# EAGLE design YOTSUBA_MC_ver.2.2.1 (EAGLE 9.6.2)
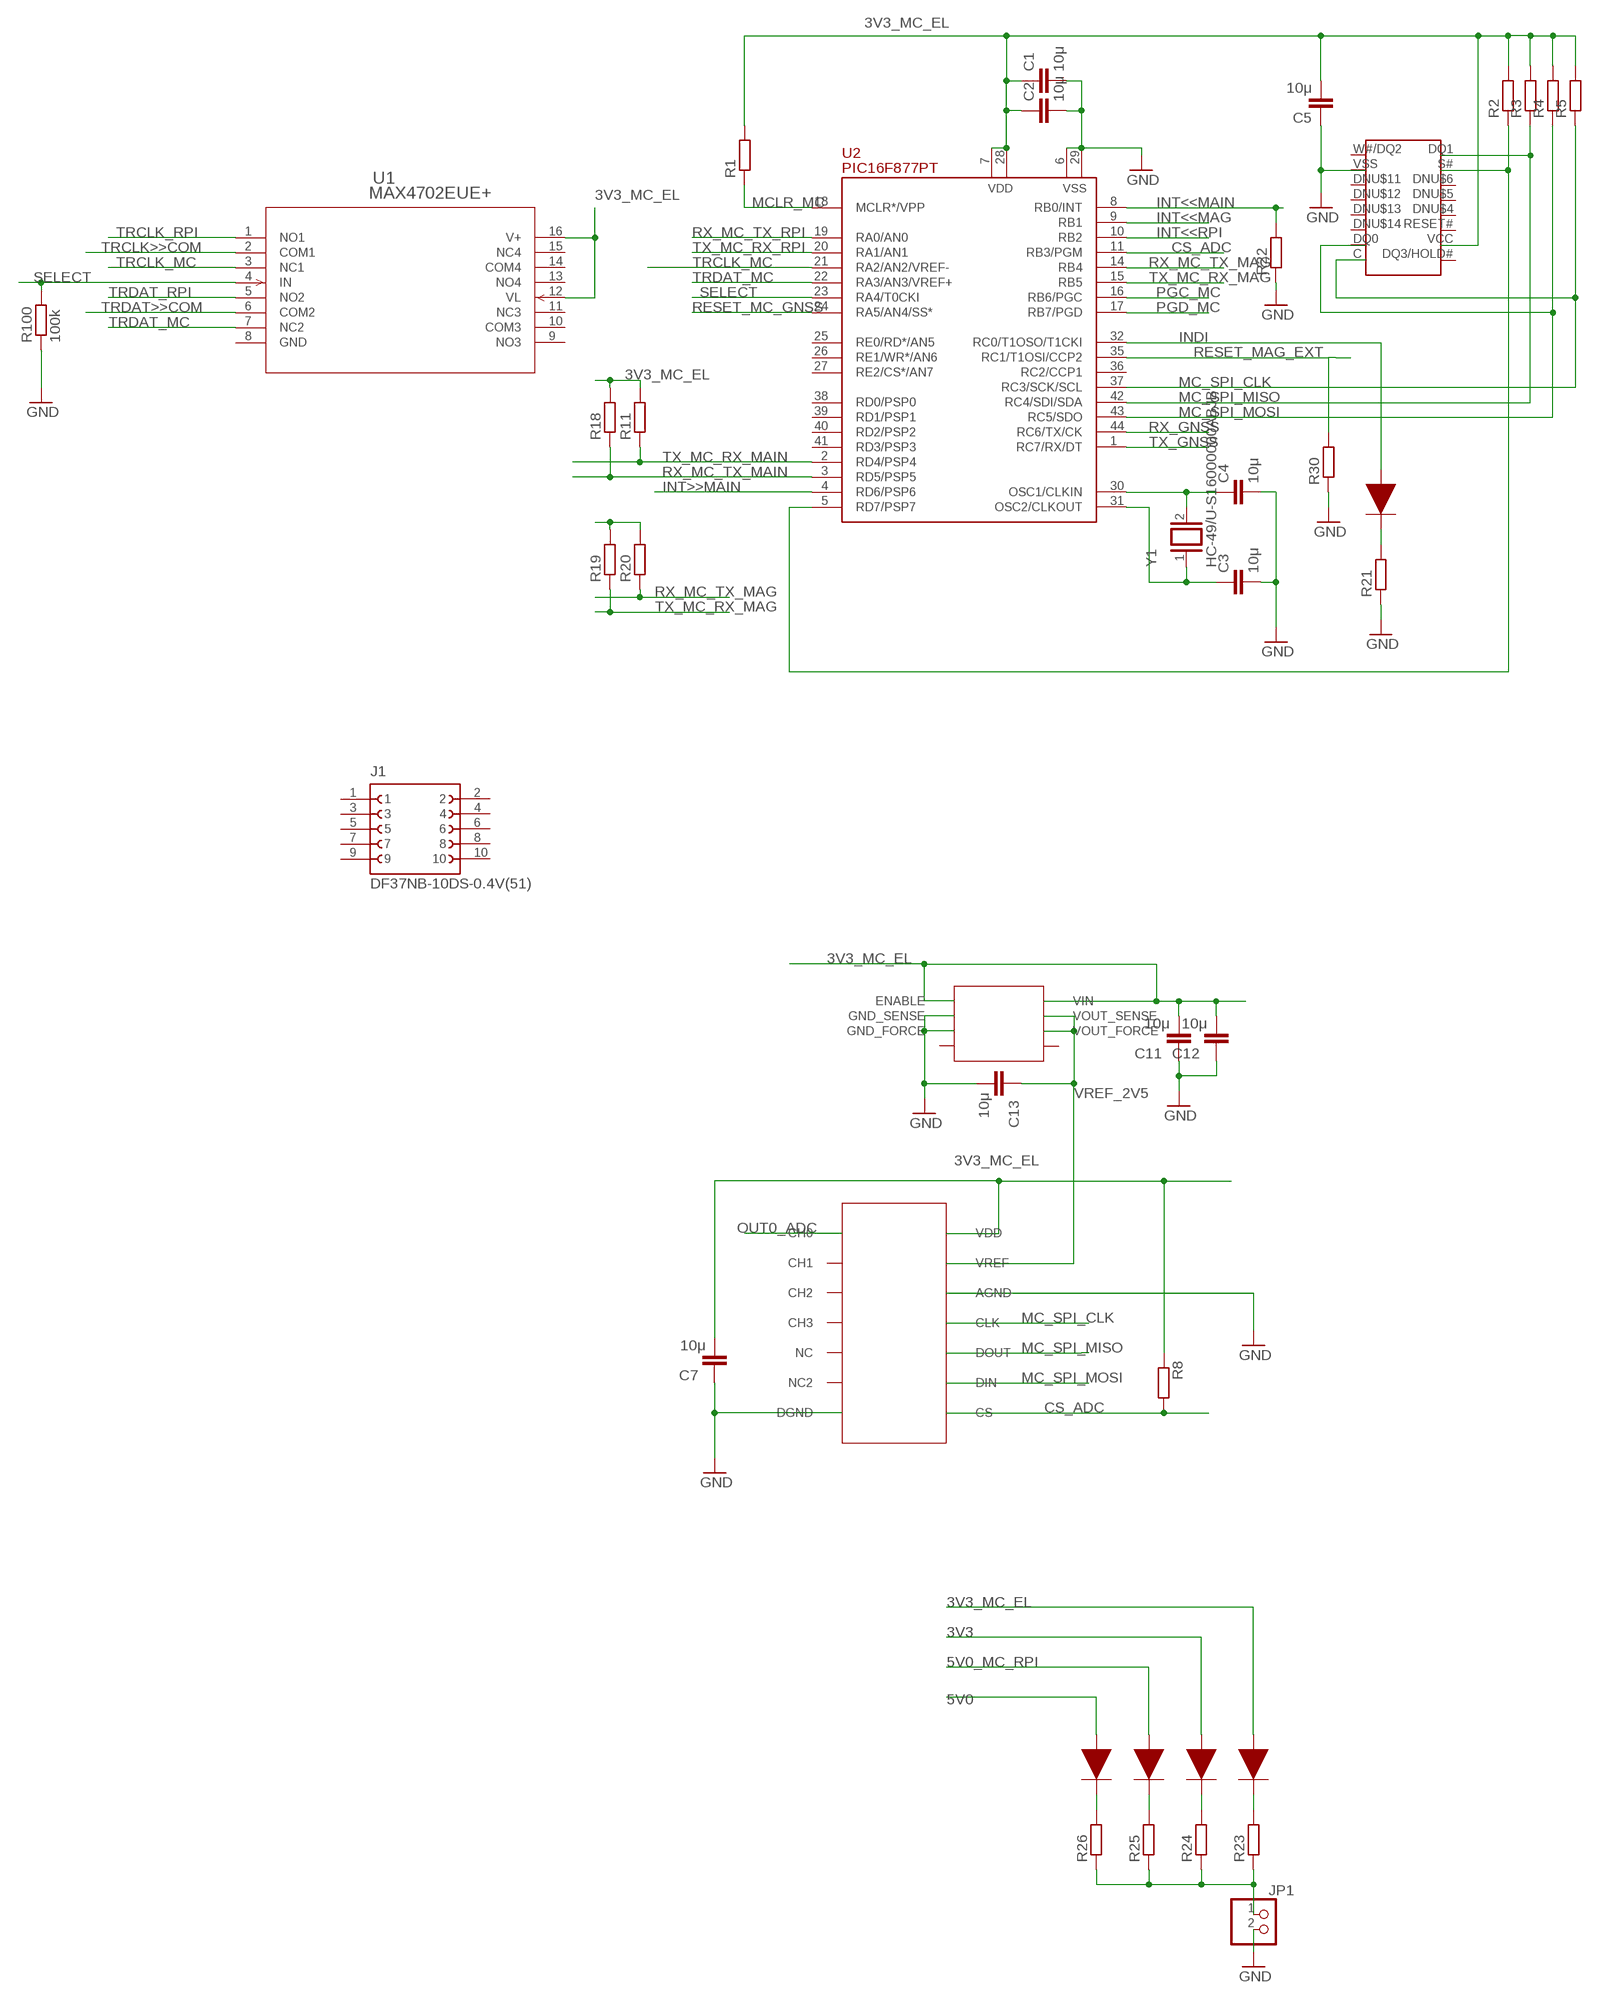
[diagram p0: schematic, sheet 1, part 1 of 2]
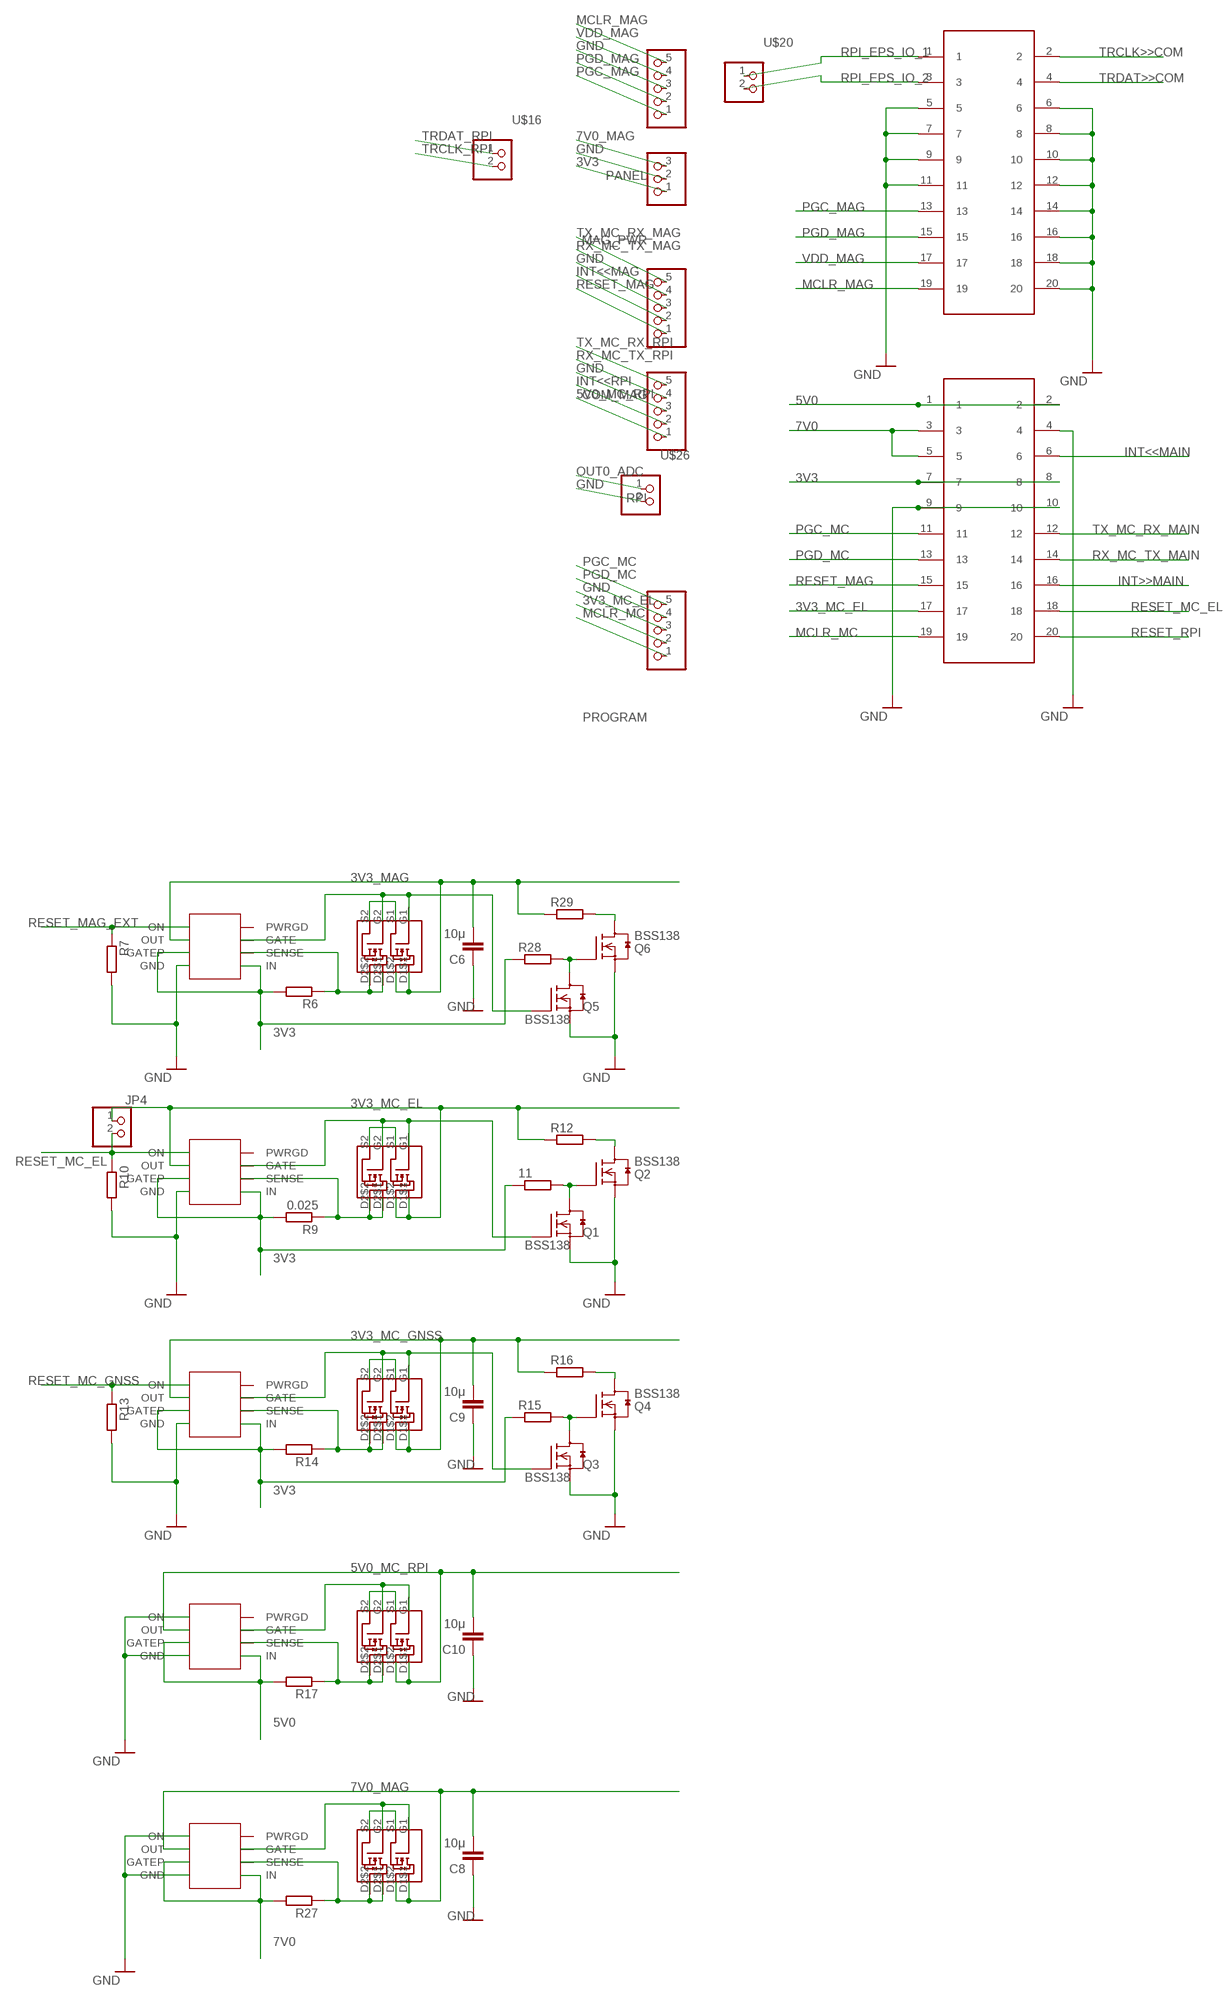
[diagram p1: schematic, sheet 1, part 2 of 2]

## Parts
11  R-EU_M2012  [M2012]
C1  10μ  C-EUC2012  [C2012]
C2  10μ  C-EUC2012  [C2012]
C3  10μ  C-EUC2012  [C2012]
C4  10μ  C-EUC2012  [C2012]
C5  10μ  C-EUC2012  [C2012]
C6  10μ  C-EUC2012  [C2012]
C7  10μ  C-EUC2012  [C2012]
C8  10μ  C-EUC2012  [C2012]
C9  10μ  C-EUC2012  [C2012]
C10  10μ  C-EUC2012  [C2012]
C11  10μ  C-EUC2012  [C2012]
C12  10μ  C-EUC2012  [C2012]
C13  10μ  C-EUC2012  [C2012]
COM_MAG  PINHD-1X5  [1X05]
J1  DF37NB-10DS-0.4V(51)  [HRS_DF37NB-10DS-0.4V(51)]
JP1  PINHD-1X2  [1X02]
JP4  PINHD-1X2  [1X02]
MAG_PWR  PINHD-1X3  [1X03]
PANEL  PINHD-1X5  [1X05]
PROGRAM  PINHD-1X5  [1X05]
Q1  BSS138  [SOT23]
Q2  BSS138  [SOT23]
Q3  BSS138  [SOT23]
Q4  BSS138  [SOT23]
Q5  BSS138  [SOT23]
Q6  BSS138  [SOT23]
R1  R-EU_M2012  [M2012]
R2  R-EU_M2012  [M2012]
R3  R-EU_M2012  [M2012]
R4  R-EU_M2012  [M2012]
R5  R-EU_M2012  [M2012]
R6  R-EU_M2012  [M2012]
R7  R-EU_M2012  [M2012]
R8  R-EU_M2012  [M2012]
R9  0.025  R-EU_M2012  [M2012]
R10  R-EU_M2012  [M2012]
R11  R-EU_M2012  [M2012]
R12  R-EU_M2012  [M2012]
R13  R-EU_M2012  [M2012]
R14  R-EU_M2012  [M2012]
R15  R-EU_M2012  [M2012]
R16  R-EU_M2012  [M2012]
R17  R-EU_M2012  [M2012]
R18  R-EU_M2012  [M2012]
R19  R-EU_M2012  [M2012]
R20  R-EU_M2012  [M2012]
R21  R-EU_M2012  [M2012]
R22  R-EU_M2012  [M2012]
R23  R-EU_M2012  [M2012]
R24  R-EU_M2012  [M2012]
R25  R-EU_M2012  [M2012]
R26  R-EU_M2012  [M2012]
R27  R-EU_M2012  [M2012]
R28  R-EU_M2012  [M2012]
R29  R-EU_M2012  [M2012]
R30  R-EU_M2012  [M2012]
R100  100k  R-EU_M2012  [M2012]
RPI  PINHD-1X5  [1X05]
U1  MAX4702EUE+  [21-0066J_16]
U2  PIC16F877PT  [TQFP44]
U$1  MT25QL512_16SOP2  [SOIC127P1032X265-16N]
U$2  DMG6898LSD  [SOIC127P600X150-8N]
U$3  LTC4361  [SOP65P280X100-8N]
U$6  MCP3204_S  [MCP3204_S]
U$7  DMG6898LSD  [SOIC127P600X150-8N]
U$8  LTC4361  [SOP65P280X100-8N]
U$9  DMG6898LSD  [SOIC127P600X150-8N]
U$10  DMG6898LSD  [SOIC127P600X150-8N]
U$11  LTC4361  [SOP65P280X100-8N]
U$12  LTC4361  [SOP65P280X100-8N]
U$13  DMG6898LSD  [SOIC127P600X150-8N]
U$14  LTC4361  [SOP65P280X100-8N]
U$16  PINHD-1X2  [1X02]
U$17  M50-3001045  [M50-3001045]
U$18  LED_1608  [LED_1608]
U$19  ADR35XX  [SOP65P490X110-8N]
U$20  PINHD-1X2  [1X02]
U$21  LED_1608  [LED_1608]
U$22  M50-3001045  [M50-3001045]
U$23  LED_1608  [LED_1608]
U$24  LED_1608  [LED_1608]
U$25  LED_1608  [LED_1608]
U$26  PINHD-1X2  [1X02]
Y1  HC-49/U-S16000000ABJB  [XTAL_HC49P488W43L1150T466H350]

## Nets
3V3 [POWER]: 11.1 MAG_PWR.1 R6.2 R9.2 R14.2 R15.1 R28.1 U$3.GATEP U$3.IN U$8.GATEP U$8.IN U$11.GATEP U$11.IN U$17.7 U$17.8 U$23.A
3V3_MAG [POWER]: C6.2 R29.1 U$2.D1$1 U$2.D1$2 U$3.OUT
3V3_MC_EL [POWER]: C1.1 C2.1 C5.2 C7.2 C11.2 C12.2 JP4.1 PROGRAM.2 R1.2 R2.2 R3.2 R4.2 R5.2 R8.1 R11.2 R12.1 R18.2 U1.12(VL) U1.16(V+) U2.7(VDD) U2.28(VDD) U$1.VCC U$6.VDD U$7.D1$1 U$7.D1$2 U$8.OUT U$17.17 U$19.ENABLE U$19.VIN U$21.A
3V3_MC_GNSS [POWER]: C9.2 R16.1 U$10.D1$1 U$10.D1$2 U$11.OUT
5V0 [POWER]: R17.2 U$14.GATEP U$14.IN U$17.1 U$17.2 U$25.A
5V0_MC_RPI [POWER]: C10.2 RPI.1 U$13.D1$1 U$13.D1$2 U$14.OUT U$24.A
7V0 [POWER]: R27.2 U$12.GATEP U$12.IN U$17.3 U$17.5
7V0_MAG [POWER]: C8.2 MAG_PWR.3 U$9.D1$1 U$9.D1$2 U$12.OUT
CS_ADC: R8.2 U2.11(RB3/PGM) U$6.CS
GND [gnd]: C1.2 C2.2 C3.2 C4.2 C5.1 C6.1 C7.1 C8.1 C9.1 C10.1 C11.1 C12.1 C13.2 COM_MAG.3 JP1.2 MAG_PWR.2 PANEL.3 PROGRAM.3 Q1.2(S) Q2.2(S) Q3.2(S) Q4.2(S) Q5.2(S) Q6.2(S) R7.2 R10.2 R13.2 R21.1 R22.1 R30.1 R100.1 RPI.3 U2.6(VSS) U2.29(VSS) U$1.VSS U$3.GND U$6.AGND U$6.DGND U$8.GND U$11.GND U$12.GND U$12.ON U$14.GND U$14.ON U$17.4 U$17.9 U$17.10 U$19.GND_FORCE U$19.GND_SENSE U$22.5 U$22.6 U$22.7 U$22.8 U$22.9 U$22.10 U$22.11 U$22.12 U$22.14 U$22.16 U$22.18 U$22.20 U$26.2
INDI: U2.32(RC0/T1OSO/T1CKI) U$18.A
INT<<MAG: COM_MAG.2 U2.9(RB1)
INT<<MAIN: R22.2 U2.8(RB0/INT) U$17.6
INT<<RPI: RPI.2 U2.10(RB2)
INT>>MAIN: U2.4(RD6/PSP6) U$17.16
MC_SPI_CLK: R5.1 U2.37(RC3/SCK/SCL) U$1.C U$6.CLK
MC_SPI_MISO: R3.1 U2.42(RC4/SDI/SDA) U$1.DQ1 U$6.DOUT
MC_SPI_MOSI: R4.1 U2.43(RC5/SDO) U$1.DQ0 U$6.DIN
MCLR_MAG: PANEL.5 U$22.19
MCLR_MC: PROGRAM.1 R1.1 U2.18(MCLR*/VPP) U$17.19
N$1: R19.2 R20.2
N$2: R23.2 U$21.C
N$3: C3.1 U2.31(OSC2/CLKOUT) Y1.1
N$4: R24.2 U$23.C
N$5: C4.1 U2.30(OSC1/CLKIN) Y1.2
N$6: R25.2 U$24.C
N$7: R26.2 U$25.C
N$8: R2.1 U2.5(RD7/PSP7) U$1.S#
N$9: JP1.1 R23.1 R24.1 R25.1 R26.1
N$10: U$2.S1 U$2.S2
N$11: R6.1 U$2.D2$1 U$2.D2$2 U$3.SENSE
N$12: Q5.1(G) U$2.G1 U$2.G2 U$3.GATE
N$13: Q5.3(D) Q6.1(G) R28.2
N$14: U$9.S1 U$9.S2
N$15: R21.2 U$18.C
N$16: R27.1 U$9.D2$1 U$9.D2$2 U$12.SENSE
N$17: U$9.G1 U$9.G2 U$12.GATE
N$18: Q6.3(D) R29.2
N$19: U$7.S1 U$7.S2
N$20: R9.1 U$7.D2$1 U$7.D2$2 U$8.SENSE
N$22: Q1.1(G) U$7.G1 U$7.G2 U$8.GATE
N$24: 11.2 Q1.3(D) Q2.1(G)
N$26: Q2.3(D) R12.2
N$28: U$10.S1 U$10.S2
N$29: R14.1 U$10.D2$1 U$10.D2$2 U$11.SENSE
N$30: Q3.1(G) U$10.G1 U$10.G2 U$11.GATE
N$33: Q3.3(D) Q4.1(G) R15.2
N$34: Q4.3(D) R16.2
N$36: U$13.S1 U$13.S2
N$37: R17.1 U$13.D2$1 U$13.D2$2 U$14.SENSE
N$38: U$13.G1 U$13.G2 U$14.GATE
OUT0_ADC: U$6.CH0 U$26.1
PGC_MAG: PANEL.1 U$22.13
PGC_MC: PROGRAM.5 U2.16(RB6/PGC) U$17.11
PGD_MAG: PANEL.2 U$22.15
PGD_MC: PROGRAM.4 U2.17(RB7/PGD) U$17.13
RESET_MAG: COM_MAG.1 U$17.15
RESET_MAG_EXT: R7.1 R30.2 U2.35(RC1/T1OSI/CCP2) U$3.ON
RESET_MC_EL: JP4.2 R10.1 U$8.ON U$17.18
RESET_MC_GNSS: R13.1 U2.24(RA5/AN4/SS*) U$11.ON
RESET_RPI: U$17.20
RPI_EPS_IO_1: U$20.1 U$22.1
RPI_EPS_IO_2: U$20.2 U$22.3
RX_GNSS: U2.44(RC6/TX/CK)
RX_MC_TX_MAG: COM_MAG.4 R20.1 U2.14(RB4)
RX_MC_TX_MAIN: R18.1 U2.3(RD5/PSP5) U$17.14
RX_MC_TX_RPI: RPI.4 U2.19(RA0/AN0)
SELECT: R100.2 U1.4(IN) U2.23(RA4/T0CKI)
TRCLK>>COM: U1.2(COM1) U$22.2
TRCLK_MC: U1.3(NC1) U2.21(RA2/AN2/VREF-)
TRCLK_RPI: U1.1(NO1) U$16.1
TRDAT>>COM: U1.6(COM2) U$22.4
TRDAT_MC: U1.7(NC2) U2.22(RA3/AN3/VREF+)
TRDAT_RPI: U1.5(NO2) U$16.2
TX_GNSS: U2.1(RC7/RX/DT)
TX_MC_RX_MAG: COM_MAG.5 R19.1 U2.15(RB5)
TX_MC_RX_MAIN: R11.1 U2.2(RD4/PSP4) U$17.12
TX_MC_RX_RPI: RPI.5 U2.20(RA1/AN1)
VDD_MAG: PANEL.4 U$22.17
VREF_2V5: C13.1 U$6.VREF U$19.VOUT_FORCE U$19.VOUT_SENSE
Unconnected: J1.1 J1.2 J1.3 J1.4 J1.5 J1.6 J1.7 J1.8 J1.9 J1.10 U1.9(NO3) U1.10(COM3) U1.11(NC3) U1.13(NO4) U1.14(COM4) U1.15(NC4) U2.25(RE0/RD*/AN5) U2.26(RE1/WR*/AN6) U2.27(RE2/CS*/AN7) U2.36(RC2/CCP1) U2.38(RD0/PSP0) U2.39(RD1/PSP1) U2.40(RD2/PSP2) U2.41(RD3/PSP3) U$1.DNU$4 U$1.DNU$5 U$1.DNU$6 U$1.DNU$11 U$1.DNU$12 U$1.DNU$13 U$1.DNU$14 U$1.DQ3/HOLD# U$1.RESET# U$1.W#/DQ2 U$3.PWRGD U$6.CH1 U$6.CH2 U$6.CH3 U$6.NC1(NC) U$6.NC2 U$8.PWRGD U$11.PWRGD U$12.PWRGD U$14.PWRGD U$19.NIC@1(NIC) U$19.NIC@2(NIC)

## Power pins joined to a net without a drawn wire
GND: U1.8(GND)

## Library data of the parts
11 R1-R30 R100 = rcl:R-EU_: RESISTOR, European symbol; SPICEPREFIX: R
C1-C13 = rcl:C-EU: CAPACITOR, European symbol; SPICEPREFIX: C
COM_MAG PANEL PROGRAM RPI = pinhead:PINHD-1X5: PIN HEADER
J1 = DF37NB-10DS-0.4V_51_:DF37NB-10DS-0.4V(51): Check availability <https://pricing.snapeda.com/parts/DF37NB-10DS-0.4V%2851%29/Hirose/view-part?ref=eda>; AVAILABILITY: In Stock; DESCRIPTION: 10 Position Connector Receptacle, Center Strip Contacts Surface Mount Gold; MF: Hirose; MP: DF37NB-10DS-0.4V(51); PACKAGE: None; PRICE: None; PURCHASE-URL: https://pricing.snapeda.com/search?q=DF37NB-10DS-0.4V(51)&ref=eda
JP1 JP4 U$16 U$20 U$26 = pinhead:PINHD-1X2: PIN HEADER
MAG_PWR = pinhead:PINHD-1X3: PIN HEADER
Q1-Q6 = m-pad-2.1:BSS138: Fairchild Semiconductors BSS138 N-Channel Logic Level Enhancement Mode Field Effect Transistor General Description: These N-Channel enhancement mode field effect transistors are produced using Fairchild's proprietary, high cell density, DMOS technology. These products have been designed to minimize on-state resistance while provide rugged, reliable, and fast switching performance.These products are particularly suited for low voltage, low current applications such as small servo motor control, power MOSFET gate drivers, and other switching applications. Features: 0.22 A, 50 V. RDS(ON) = 3.5Ohm @ VGS = 10 V RDS(ON) = 6.0Ohm @ VGS = 4.5 V High density cell design for extremely low RDS(ON) Rugged and Reliable Compact industry standard SOT-23 surface mount package Please send any comments to: messi@users.sourceforge.net
U1 = MAX4702:MAX4702EUE+; COPYRIGHT: Copyright (C) 2022 Ultra Librarian. All rights reserved.; MANUFACTURER_PART_NUMBER: MAX4702EUE+; MFR_NAME: Analog Devices Inc
U2 = aoba01:PIC16F877: FLASH MICROCONTROLLER
U$1 = MT25QL512_8:MT25QL512_16SOP2
U$2 U$7 U$9 U$10 U$13 = DMG6898LSD:DMG6898LSD
U$3 U$8 U$11 U$12 U$14 = ltc4361:LTC4361
U$6 = mcp3204_S:MCP3204_S
U$17 U$22 = MITSUBA_Connectors-v4.0:M50-3001045: 20pins 1.27mm pitch 2line pinsocket
U$18 U$21 U$23-U$25 = LED_1608:LED_1608
U$19 = adr35xx:ADR35XX
Y1 = HC-49_U-S16000000ABJB:HC-49/U-S16000000ABJB: HC49US Series 16 MHz ±30 ppm 18 pF -20 to +70 °C Through Hole AT-CUT Crystal; DESCRIPTION: 16 MHz ±30ppm Crystal 18pF 50 Ohms HC-49/US; DIGI-KEY_PART_NUMBER: 300-6034-ND; MF: Citizen Finedevice Co Ltd; MP: HC-49/U-S16000000ABJB; PACKAGE: HC-49/US Citizen Finetech Miyota; PURCHASE-URL: https://pricing.snapeda.com/search?q=HC-49/U-S16000000ABJB&ref=eda

## Net classes
0 default: clearance 0.178 mm
1 ant: clearance 0.559 mm
2 gnd: clearance 0.508 mm
3 POWER: width 0.305 mm, clearance 0.254 mm

## Board
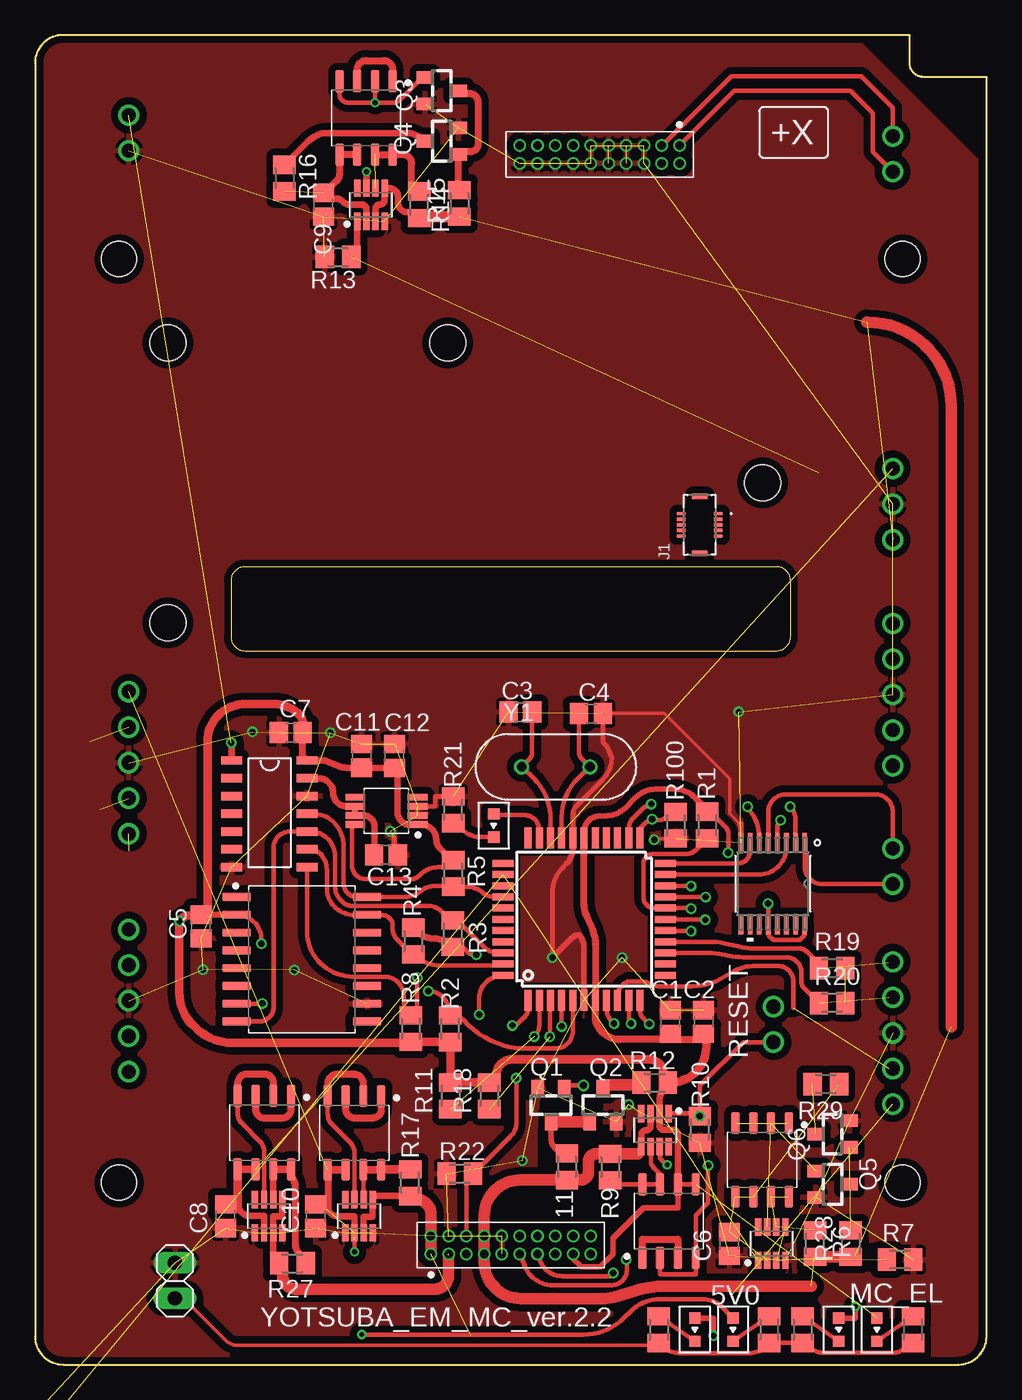
[diagram p2: board, top side]
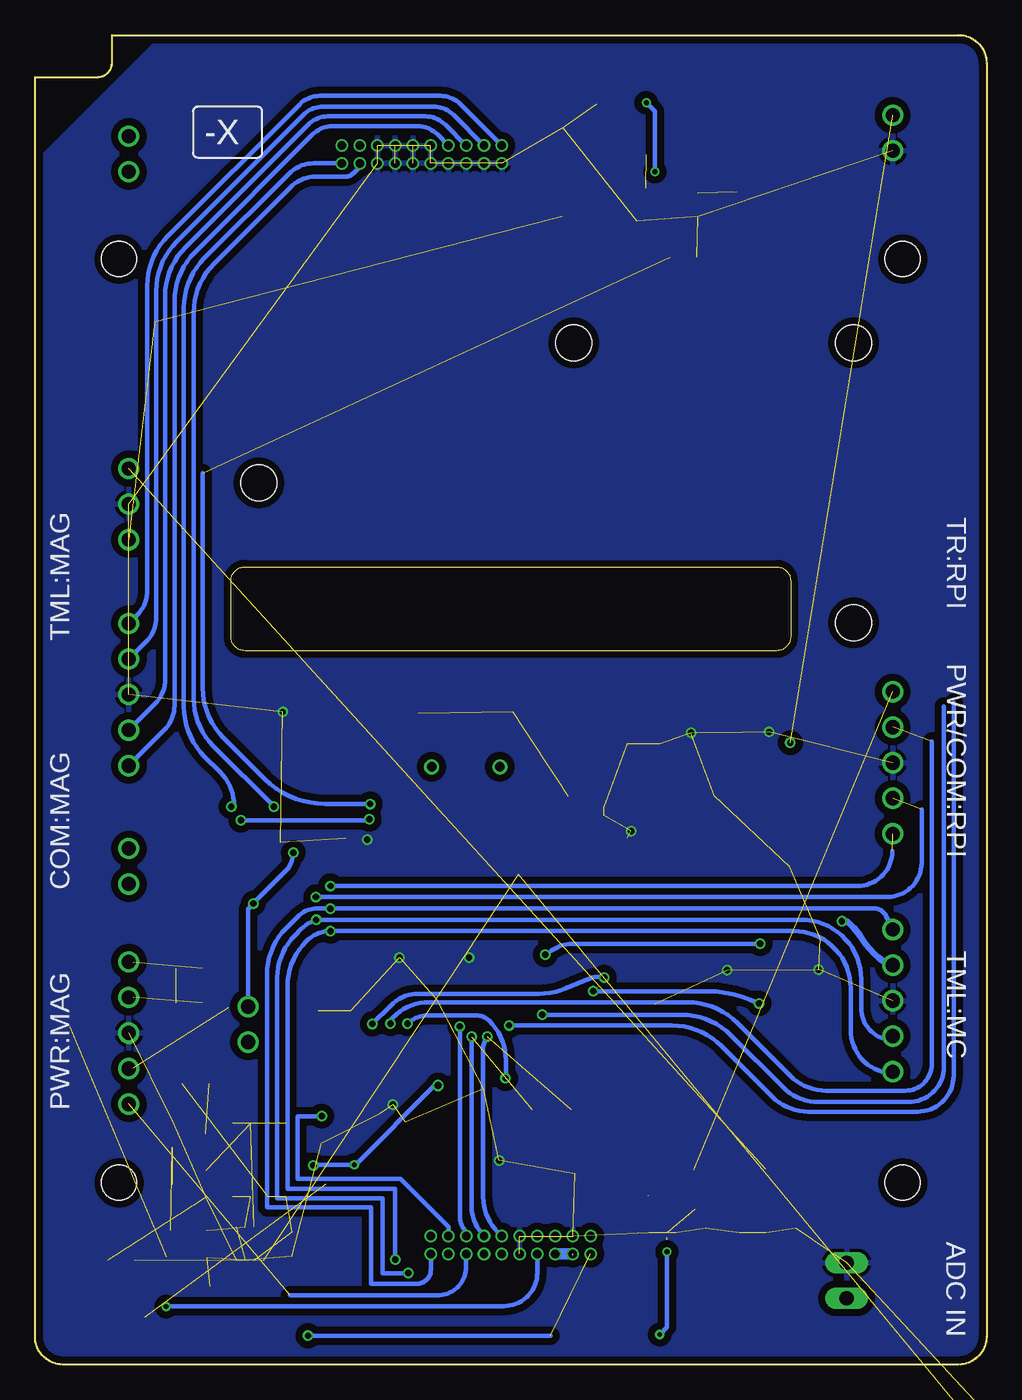
[diagram p3: board, bottom side, seen from below]

Size 68 x 95 mm. Coordinates in mm from the lower left corner, seen from the top.
Outline: 0,93 0,2 arc90 2,0 66,0 arc90 68,2 68,92 63.5,92 arc-90 62.5,93 62.5,95 2,95 arc90 0,93
Outline: 14,56 14,52 arc90 15,51 53,51 arc90 54,52 54,56 arc90 53,57 15,57 arc90 14,56
Copper layers (1*16): Top 0.035mm / dielectric 1.53mm / Bottom 0.035mm
Design rules "pban_5mil-l2": minimum track width 5mil, minimum drill 0.3mm, track to track 5mil, track to pad 0.229mm, pad to pad 5mil, via to via 5mil, smd to smd 5mil, copper to edge 0.5mm, drill to drill 0.5mm, minimum pad ring 0.15mm, minimum via ring 0.15mm, stop-mask expansion 4mil, vias tented up to drill 0.35mm, thermal gap 10mil
Holes 2.5 mm at 6,13 62,13 62,79 6,79
Holes 2.6 mm at 9.5,73 9.5,53 52,63 29.5,73
tRestrict: area 26,35.8 to 27.6,38; area 25,23.7 to 25.7,27.1; area 36.2,18.2 to 40.5,19; area 35.1,19 to 37,21; area 34.9,19 to 35.4,20; area 33,7 to 34,7.4; area 32.9,9.8 to 33.8,10.3; area 46.5,14.1 to 47.2,14.9; area 36,14.1 to 36.8,16.6; area 40.2,15.8 to 42.6,16.6; area 41.4,18.6 to 43.1,19.2; area 20.2,43.7 to 22.3,44.1; area 24.3,43.8 to 24.7,44.1; area 23.6,41 to 24,41.6; area 43.8,25.1 to 44.6,26.5; area 46.3,24.6 to 46.8,25.2; area 46.3,25.5 to 46.9,25.7; area 15,33.9 to 16.7,34.2; area 24.9,38.7 to 25.5,39; area 50.7,38.3 to 51,39; area 47.2,18.8 to 47.9,20.3; area 28.2,39.1 to 28.9,39.7
bRestrict: area 32.9,6.8 to 33.9,7.5; area 6.4,24.7 to 6.9,25

### Footprints (pad centres in the part's own frame; a part is rotated, then mirrored left to right if it is on the bottom)
M2012 = smd 1.3 x 1.6: 1 -0.95,0; 2 0.95,0
C2012 = smd 1.3 x 1.5: 1 -0.85,0; 2 0.85,0
1X05 = drill 1.016: 1 -5.08,0; 2 -2.54,0; 3 0,0; 4 2.54,0; 5 5.08,0
HRS_DF37NB-10DS-0.4V(51) = smd 0.23 x 0.63: 1 0.8,-1.325; 2 0.8,1.325; 3 0.4,-1.325; 4 0.4,1.325; 5 0,-1.325; 6 0,1.325; 7 -0.4,-1.325; 8 -0.4,1.325; 9 -0.8,-1.325; 10 -0.8,1.325 | smd 0.38 x 1.1: S1 2.04,0; S2 -2.04,0
1X02 = drill 1.016 long: 1 -1.27,0; 2 1.27,0
1X02' = drill 1.016: 1 -1.27,0; 2 1.27,0
1X03 = drill 1.016: 1 -2.54,0; 2 0,0; 3 2.54,0
SOT23 = smd 0.9 x 1.2: 1 -0.95,-1.2; 2 0.95,-1.2; 3 0,1.2
21-0066J_16 = smd 1.379 x 0.34: 1 -2.937,2.275; 2 -2.937,1.625; 3 -2.937,0.975; 5 -2.937,-0.325; 6 -2.937,-0.975; 7 -2.937,-1.625; 8 -2.937,-2.275; 9 2.937,-2.275; 10 2.937,-1.625; 11 2.937,-0.975; 12 2.937,-0.325; 13 2.937,0.325; 14 2.937,0.975; 15 2.937,1.625; 16 2.937,2.275 | smd 1.379 x 0.3: 4 -2.937,0.325
TQFP44 = smd 1.5 x 0.5: 1 -5.8,4; 2 -5.8,3.2; 3 -5.8,2.4; 4 -5.8,1.6; 5 -5.8,0.8; 6 -5.8,0; 7 -5.8,-0.8; 8 -5.8,-1.6; 9 -5.8,-2.4; 10 -5.8,-3.2; 11 -5.8,-4; 23 5.8,-4; 24 5.8,-3.2; 25 5.8,-2.4; 26 5.8,-1.6; 27 5.8,-0.8; 28 5.8,0; 29 5.8,0.8; 30 5.8,1.6; 31 5.8,2.4; 32 5.8,3.2; 33 5.8,4 | smd 0.5 x 1.5: 12 -4,-5.8; 13 -3.2,-5.8; 14 -2.4,-5.8; 15 -1.6,-5.8; 16 -0.8,-5.8; 17 0,-5.8; 18 0.8,-5.8; 19 1.6,-5.8; 20 2.4,-5.8; 21 3.2,-5.8; 22 4,-5.8; 34 4,5.8; 35 3.2,5.8; 36 2.4,5.8; 37 1.6,5.8; 38 0.8,5.8; 39 0,5.8; 40 -0.8,5.8; 41 -1.6,5.8; 42 -2.4,5.8; 43 -3.2,5.8; 44 -4,5.8
SOIC127P1032X265-16N = smd 2.052 x 0.602: C 4.654,4.445; DNU$4 -4.654,0.635; DNU$5 -4.654,-0.635; DNU$6 -4.654,-1.905; DNU$11 4.654,-1.905; DNU$12 4.654,-0.635; DNU$13 4.654,0.635; DNU$14 4.654,1.905; DQ0 4.654,3.175; DQ1 -4.654,-4.445; DQ3/HOLD# -4.654,4.445; RESET# -4.654,1.905; S# -4.654,-3.175; VCC -4.654,3.175; VSS 4.654,-3.175; W#/DQ2 4.654,-4.445
SOIC127P600X150-8N = smd 1.58 x 0.589: D1$1 -2.625,1.905; D1$2 -2.625,0.635; D2$1 -2.625,-0.635; D2$2 -2.625,-1.905; G1 2.625,1.905; G2 2.625,-0.635; S1 2.625,0.635; S2 2.625,-1.905
SOP65P280X100-8N = smd 1.237 x 0.459: GATE 1.187,0.325; GATEP -1.187,-0.325; GND -1.187,-0.975; IN 1.187,-0.975; ON -1.187,0.975; OUT -1.187,0.325; PWRGD 1.187,0.975; SENSE 1.187,-0.325
MCP3204_S = smd 0.6 x 1.5: AGND 2.54,0; CH0 0,-5.4; CH1 1.27,-5.4; CH2 2.54,-5.4; CH3 3.81,-5.4; CLK 3.81,0; CS 7.62,0; DGND 7.62,-5.4; DIN 6.35,0; DOUT 5.08,0; NC1 5.08,-5.4; NC2 6.35,-5.4; VDD 0,0; VREF 1.27,0
M50-3001045 = drill 0.6: 1 0,0; 2 0,1.27; 3 1.27,0; 4 1.27,1.27; 5 2.54,0; 6 2.54,1.27; 7 3.81,0; 8 3.81,1.27; 9 5.08,0; 10 5.08,1.27; 11 6.35,0; 12 6.35,1.27; 13 7.62,0; 14 7.62,1.27; 15 8.89,0; 16 8.89,1.27; 17 10.16,0; 18 10.16,1.27; 19 11.43,0; 20 11.43,1.27
LED_1608 = smd 0.8 x 0.8: A 0.4,0.4; C 2.05,0.4
SOP65P490X110-8N = smd 1.424 x 0.497: ENABLE -2.219,0.975; GND_FORCE -2.219,-0.325; GND_SENSE -2.219,0.325; NIC@1 -2.219,-0.975; NIC@2 2.219,-0.975; VIN 2.219,0.975; VOUT_FORCE 2.219,-0.325; VOUT_SENSE 2.219,0.325
XTAL_HC49P488W43L1150T466H350 = drill 0.68 pad 1.08: 1 -2.44,0; 2 2.44,0

### Placement (x,y rotation side)
11  38.02,14.13 90 top
C1  45.4,24.47 90 top
C2  47.78,24.47 90 top
C3  34.68,46.62 180 top
C4  39.73,46.51 0 top
C5  11.87,31.29 90 top
C6  49.61,8.62 90 top
C7  18.28,45.16 0 top
C8  13.61,10.6 90 top
C9  20.62,82.87 90 top
C10  20.07,10.6 90 top
C11  23.35,43.49 270 top
C12  25.69,43.48 270 top
C13  25.08,36.42 0 top
COM_MAG  61.3,23.69 90 top
J1  47.5,60 90 top
JP1  10,6 90 top
JP4  [1X02']  52.77,24.3 270 top
MAG_PWR  61.3,61.48 90 top
PANEL  61.3,47.87 90 top
PROGRAM  6.7,26 270 top
Q1  36.88,18.54 180 top
Q2  40.59,18.55 0 top
Q3  29.07,91.01 270 top
Q4  29.07,87.41 90 top
Q5  57,12.88 270 top
Q6  56.99,16.47 90 top
R1  48.03,38.55 90 top
R2  29.68,23.99 270 top
R3  29.87,30.78 270 top
R4  27.04,30.26 90 top
R5  29.88,35.09 90 top
R6  55.74,8.64 270 top
R7  61.82,7.5 0 top
R8  26.86,24 90 top
R9  41.1,14.11 90 top
R10  47.52,16.8 270 top
R11  29.69,19.2 90 top
R12  44.29,20.15 180 top
R13  21.66,79.13 180 top
R14  27.46,82.87 270 top
R15  30.33,82.96 90 top
R16  17.83,84.77 90 top
R17  26.81,12.99 270 top
R18  32.47,19.2 90 top
R19  56.97,28.31 0 top
R20  56.97,25.83 0 top
R21  29.89,39.63 270 top
R22  30.36,13.63 0 top
R23  62.74,2.49 90 top
R24  54.86,2.49 90 top
R25  52.46,2.49 90 top
R26  44.58,2.49 90 top
R27  18.4,7.24 180 top
R28  58.29,8.64 90 top
R29  56.52,20.05 180 top
R30  -1.83,-6.49 0 top  (outside the outline)
R100  45.79,38.54 90 top
RPI  6.7,43 270 top
U1  52.73,34.36 270 top
U2  39.24,31.81 90 top
U$1  19.07,28.96 0 top
U$2  51.96,14.62 90 top
U$3  52.65,8.64 90 top
U$6  19.44,43.16 270 top
U$7  45.31,10.24 270 top
U$8  44.31,16.75 270 top
U$9  16.4,16.58 90 top
U$10  23.66,89.08 90 top
U$11  24.01,82.87 90 top
U$12  16.7,10.6 90 top
U$13  22.83,16.55 90 top
U$14  23.16,10.6 90 top
U$16  [1X02']  61.3,35.6 90 top
U$17  28.29,7.9 0 top
U$18  32.38,39.73 270 top
U$19  25.11,39.56 180 top
U$20  [1X02']  61.3,86.5 90 top
U$21  59.77,3.71 270 top
U$22  46.07,87.1 180 top
U$23  57.03,3.71 270 top
U$24  49.49,3.71 270 top
U$25  46.75,3.71 270 top
U$26  [1X02']  6.7,88 270 top
Y1  37.22,42.71 0 top

### Tracks (layer width: path | path; a pad name or v marks a point on that pad's centre or on a via)
3V3  (via drill 0.35)  (6 unrouted)
  Top 0.305: 40.96,15.06 41.07,15.17 | 41.21,15.17 R9.2 41.26,15.06 | 43.34,15.44 U$8.IN 43.34,15.48 arc-90 43.3,15.44
  Top 0.406: 43.09,15.06 43.3,15.06 43.3,15.44 | U$23.A 58.63,3.31 v58.63,4.14
  Top 0.45: U$8.GATEP 43.98,17.05 arc-90 43.67,16.73 43.65,16.73 arc90 43.33,16.41 43.33,15.44 43.34,15.44 | 41.21,15.17 41.07,15.17 | U$11.GATEP 24.34,82.57 arc-90 24.66,82.89 24.67,82.89 arc90 24.98,83.2 U$11.IN 25.32,84.06 arc-90 25.95,83.42 25.95,82.97 arc90 26.59,82.34 27.04,82.34 R14.2
  Top 0.813: 59.46,74.48 arc-90 65.48,68.46 65.48,24.13 | 40.96,15.06 40.1,15.06 arc90 39.56,14.52 39.56,13.76 arc-90 38.98,13.18 11.1 34.65,13.18 arc90 32.1,10.63 U$17.8 U$17.7 32.1,7.35 arc90 34.74,4.71 40.66,4.71 41.38,4.82 43.37,5.42 44.48,5.58 55.49,5.58 | R9.2 43.09,15.06 | R14.2 27.55,82.01 R15.1 | 55.68,7.63 R6.2 R28.1 58.58,7.69
  Bottom 0.305: U$17.8 32.1,9.31 | U$17.7 32.1,6.58 arc90 34.5,4.17 58.6,4.17 v58.63,4.14
3V3_MAG  (4 unrouted)
3V3_MC_EL  (via drill 0.45)  (1 unrouted)
  Top 0.305: 45.51,20.42 R12.1 45.24,20.05 45.24,19.84 | U$8.OUT 44.62,17.95 | U$7.D1$2 U$7.D1$1 | 27.32,31.21 R4.2 27.32,31.49 27.58,31.49 | 29.65,29.91 29.79,29.91 R3.2 29.94,29.76 30.62,29.76 30.91,29.48 arc45 31.36,29.29 v31.54,29.29 | 14.31,32.13 U$1.VCC arc-90 16.18,30.37 v16.18,30.07 | 27.6,38.59 U$19.ENABLE | 29.27,36.54 29.66,36.15 29.77,36.15 R5.2 29.67,36.04 29.17,35.54 28.84,35.54 arc45 27.56,35.01 27.52,34.97 arc-45 26.82,34.68 23.65,34.68 arc-90 22.65,35.68 22.65,38.34 U$19.VIN 23.32,38.59 | R8.1 26.68,22.88 | 26.45,23.11 26.22,22.88 | U1.16 55.01,30.8 arc-45 54.91,30.58 54.76,30.43 arc-45 54.54,30.34 52.87,30.34 arc-45 52.65,30.43 52.51,30.56 arc-45 52.42,30.79 52.42,31.41 U1.12 v52.41,32.94 v52.4,32.94 | R1.2 48.27,39.5 49.34,38.42 arc-45 49.57,37.88 49.57,36.59 v49.55,36.56 | U$21.A 60.17,3.37
  Top 0.406: U$17.17 38.45,7.56 39.04,6.97 40.39,6.97 41.31,7.89 41.31,9.02 43.49,11.2 45.95,11.2 U$7.D1$2 | U2.28 39.24,38.05 arc-45 39.58,38.88 arc-45 40.38,39.21 40.8,39.21 arc45 42.18,39.78 42.92,40.52 arc-45 44.35,41.11 45.67,41.11 arc-45 47.2,40.48 48.03,39.65 R1.2
  Top 0.45: U$7.D1$2 45.95,16.43 arc90 45.62,16.76 44.95,16.76 arc-90 44.63,17.08 U$8.OUT 44.63,18.97 arc-45 44.82,19.42 45.24,19.84 | U$6.VDD 20.49,43.16 arc-22 20.98,43.06 21.77,42.74 arc22 22.25,42.64 C11.2 C12.2 arc-90 25.91,42.41 25.91,39.49 arc90 26.86,38.54 arc-90 26.9,38.59 U$19.ENABLE 27.57,38.59 arc-90 28.68,37.48 arc45 28.92,36.9 29.27,36.55 29.27,36.54 | R5.2 arc-45 30,36.04 | 29.79,29.91 arc45 28.49,30.45 28.41,30.45 arc-45 27.37,30.88 R4.2 27.27,31.44 | C5.2 14.29,32.15 14.31,32.13
  Top 0.508: U2.28 39.23,33.02 arc23 39.42,32.06 39.86,31 arc-23 40.05,30.05 U2.7 40.04,24.91 arc45 40.52,23.76 arc45 41.83,23.22 45,23.22 C1.1 45.81,23.21 47.37,23.21 C2.1 | R4.2 27.09,31.16 | U$6.VDD 19.13,43.47 C7.2
  Top 0.61: 47.82,23.58 C2.1 47.97,23.43 47.97,23.42 | 47.97,23.42 48.11,23.28 | 45.31,20.12 45.24,20.05 | R2.2 arc23 R2.2 arc90 R2.2 | 27.62,23.05 R8.1 R2.2 | 11.84,32.11 11.43,32.1 | 11.86,32.15 arc-90 C5.2 | C7.2 19.13,45.89 arc45 18.91,46.43 arc45 17.07,47.19 15.05,47.19 arc45 13.09,46.38 arc45 12.34,44.57 12.34,32.61 C5.2 | 26.58,22.98 14.11,22.98 arc-45 11.46,24.07 11.25,24.29 arc-45 10.31,26.54 10.31,31.66 v10.33,31.68 10.33,31.71 10.42,31.8 arc-45 11.15,32.11 11.84,32.11 | 26.45,23.11 26.58,22.98 | 26.58,22.98 arc-90 26.68,22.88 | 11.84,32.11 C5.2 | 47.97,23.42 47.97,22.69 arc-90 45.43,20.15 R12.1 44.9,20.49 44.9,20.8 arc90 43.9,21.8 34.09,21.8 arc90 32.96,20.66 32.96,20.64 R18.2 R11.2 R2.2 | R2.2
  Top 0.813: C2.1 47.82,23.62 48.07,23.37
  Bottom 0.305: v49.55,36.56 arc45 50.09,35.25 v52.4,32.94 52.77,32.57 JP4.1 | v16.18,30.07 16.38,30.07 16.39,30.06 29.57,30.06 arc-45 31.42,29.29 v31.54,29.29
  Bottom 0.45: 6.84,28.46 6.84,28.41 PROGRAM.2 6.65,28.35 7.04,28.59 arc26 8.86,30.38 arc-13 9.75,31.49 arc-45 10.19,31.68 v10.33,31.68
3V3_MC_GNSS  (1 unrouted)
  Top 0.45: U$11.OUT 23.68,82.55 arc90 23.35,82.88 22.49,82.88 arc-45 22.03,83.07 21.97,83.13 arc45 21.56,83.3 21.04,83.3 C9.2
  Top 0.5: U$10.D1$2 U$10.D1$1 21.75,85.02 arc-45 21.57,84.57 20.71,83.72 arc-90 C9.2
5V0  (via drill 0.45)  (2 unrouted)
  Top 0.305: U$14.IN 24.13,11.77 | 24.13,12.05 24.16,12.05
  Top 0.406: 24.13,11.76 24.13,11.77 24.13,12.05 | U$25.A 48.49,3.31 v48.49,2.06
  Top 0.45: 24.14,11.33 U$14.IN 24.14,10.56 23.48,10.56 U$14.GATEP | 26.74,11.97 R17.2 24.19,12.04 24.19,12.05
  Top 0.813: U$17.1 U$17.2 28.29,10.79 arc90 27.29,11.79 27.06,11.79 R17.2
  Bottom 0.305: 31.17,2.06 v48.49,2.06
5V0_MC_RPI  (via drill 0.35)  (3 unrouted)
  Top 0.305: U$14.OUT 22.84,9.09 | v23.36,2.14 39.2,2.14 arc45 42.09,3.34 42.54,3.78 arc-45 44.65,4.66 47.79,4.66 arc-45 49.08,4.12 U$24.A | 22.84,8.9 22.84,8.2 22.82,8.18 22.82,8.07 v22.84,8.05
  Top 0.45: U$14.OUT 22.84,10.58 21.77,10.58 arc-45 21.06,10.87 20.88,11.06
  Top 0.5: U$13.D1$1 20.95,13.9 20.95,11.06 20.88,11.06 | 20.84,11.1 20.84,11.13 20.3,11.13 C10.2
  Top 0.55: U$13.D1$1 U$13.D1$2
  Bottom 0.305: v23.36,2.14 22.84,2.65 v22.84,8.05
7V0  (1 unrouted)
  Top 0.45: U$12.IN 17.68,10.6 17.02,10.6 U$12.GATEP 17.02,7.24 R27.2
  Top 0.6: R27.2 17.69,7
  Top 0.813: 17.69,7 17.69,6.38 arc90 18.69,5.38 28.56,5.38 arc90 29.56,6.38 29.56,7.81
  Bottom 0.813: U$17.3 U$17.5
7V0_MAG  (1 unrouted)
  Top 0.45: U$12.OUT 16.38,10.61 15.43,10.61 arc-45 14.72,10.9 14.49,11.13
  Top 0.55: U$9.D1$2 U$9.D1$1
  Top 0.61: U$9.D1$1 14.49,11.13 13.95,11.13 C8.2
CS_ADC  (via drill 0.45)
  Top 0.305: U$6.CS 19.44,30.99 arc45 20.4,28.67 arc45 22.72,27.71 24.97,27.71 arc-90 26.36,26.32 26.36,25.45 R8.2 arc45 27.23,25.32 27.32,25.54 v27.32,27.66 | U2.11 43.24,25.26 arc45 43.42,24.81 v43.9,24.34
  Bottom 0.305: v43.9,24.34 42.56,25.68 arc45 40.59,26.49 31.99,26.49 arc-23 30.07,26.87 28.17,27.66 arc23 v27.32,27.66
GND  (via drill 0.45)  (67 unrouted)
  Top 0.2: 50.38,38.63 49.65,39.36 49.65,41.85 44.98,46.52 C4.2 | v44.26,37.5 44.35,37.59 R100.1
  Top 0.305: U$19.GND_FORCE 28.6,39.88 28.6,40.6 29.89,40.6 R21.1 | 38.44,39.36 arc-45 38.65,39.87 40.59,41.81 arc45 41.22,43.33 40.87,44.16 40.58,44.45 C4.2 | U2.29 38.44,36.88 | 37.99,35.79 37.72,35.52 arc45 36.98,33.73 v36.98,29.08
  Top 0.406: U2.29 38.44,39.36 | 38.44,36.88 arc-45 37.99,35.79 | U2.6 39.24,29.8 arc45 38.87,30.69 arc45 38.39,30.49 v36.98,29.08 | U1.8 50.45,38.55 arc90 50.38,38.63 | C13.2 25.67,36.42 25.67,37.62
  other vias: 41.95,29.08 15.53,45.2 25.4,38.11 42.42,18.58 21.11,45.14 18.53,28.18 50.3,46.63 12,28.22 34.83,14.58
  pour Top: -3.57,2.53 -3.57,95.52 -0.6,98.49 54.78,98.49 71.29,81.98 71.29,1.73 66.43,-3.13 2.09,-3.13
  pour Bottom: -2.1,2.16 -2.1,94.28 0.73,97.11 56.56,97.11 69.8,83.87 69.8,0.99 66.39,-2.42 2.48,-2.42
INDI
  Top 0.305: U2.32 36.04,38.18 arc90 34.96,39.26 32.85,39.26 arc-90 U$18.A
INT<<MAG  (1 unrouted)
  Top 0.305: U2.9 41.64,26.36 arc-45 41.93,27.06 42.02,27.15 arc-45 42.6,27.39 43.19,27.39 arc-26 43.81,27.25 43.86,27.22 arc26 44.66,27.03 46.99,27.03 arc29 48.96,27.55 49.97,28.12 arc-29 51.31,28.47 53.09,28.47 arc-90 54.2,27.36 54.2,25.5 | 61.02,21.17 COM_MAG.2
INT<<MAIN  (via drill 0.45)
  Top 0.305: U2.8 40.84,25.46 arc45 41.24,24.49 v41.38,24.35 | v34.38,20.45 34.41,20.42 34.41,17.33 arc-45 33.98,16.3 R22.2 30.83,13.15 U$17.6
  Bottom 0.305: v41.38,24.35 arc45 39.96,24.94 36.44,24.94 arc45 35.52,24.56 arc45 34.35,21.73 34.35,20.45 v34.38,20.45
INT<<RPI  (via drill 0.45)  (1 unrouted)
  Top 0.305: U2.10 42.44,24.5 v42.59,24.35
  Bottom 0.305: v42.59,24.35 42.59,24.64 42.41,24.82 arc45 39.85,25.88 21.35,25.88 arc45 17.82,24.42 14.03,20.63 arc-45 11.47,19.57 5.8,19.57 arc-90 3.91,21.46 3.91,44.53
INT>>MAIN  (via drill 0.45)
  Top 0.305: U2.4 37.62,25.99 37.62,24.16 v37.64,24.16
  Bottom 0.305: v37.64,24.16 37.64,10.6 arc-45 37.18,9.49 U$17.16
MC_SPI_CLK
  Top 0.305: U$6.CLK 19.91,39.35 arc-45 21.33,38.76 21.33,38.76 arc-45 22.06,37 22.06,34.37 arc45 22.34,33.68 arc45 23.01,33.41 U$1.C 26.43,33.41 arc45 27.66,33.91 27.56,33.81 arc-45 28.45,34.18 29.84,34.18 R5.1 30.86,34.14 arc-45 32.09,33.63 31.94,33.78 arc45 32.84,33.41 U2.37
MC_SPI_MISO
  Top 0.305: U2.42 33.05,29.41 arc-45 32.16,29.78 30.21,31.73 R3.1 29.74,31.73 29.18,32.29 arc45 28,32.78 22.62,32.78 arc-45 21.99,33.04 21.83,33.2 arc-45 21.45,34.12 21.45,36.31 arc45 20.93,37.56 arc45 19.68,38.08 U$6.DOUT 18.21,38.08 arc90 17.04,36.91 17.04,25.52 arc-90 16.04,24.52 U$1.DQ1
MC_SPI_MOSI
  Top 0.305: U$6.DIN 19.64,36.81 arc-45 20.38,36.5 arc-45 20.86,35.35 20.86,34.02 arc45 21.41,32.71 arc45 22.78,32.13 U$1.DQ0 24.68,32.13 arc-45 25.39,31.84 arc-45 25.56,31.43 25.56,31.08 arc45 25.83,30.43 26.95,29.31 R4.1 27.2,29.31 27.36,29.15 arc45 28.9,28.51 33.34,28.51 U2.43
MCLR_MAG
  Bottom 0.305: U$22.19 37.6,90.06 arc-45 39.02,90.65 47.65,90.65 arc-45 49.07,90.06 58.52,80.61 arc-45 59.98,77.08 59.98,55.31 arc45 60.71,53.54 PANEL.5
MCLR_MC  (via drill 0.45)
  Top 0.305: v46.89,32.58 46.89,32.61 U2.18 44.28,32.61 arc-90 43.47,33.42 43.47,35.74 arc-90 44.21,36.48 46.55,36.48 arc45 47.19,36.75 47.99,37.55 arc45 47.99,37.56 R1.1
  Bottom 0.305: U$17.19 39.71,6.78 arc90 40.73,5.76 44,5.76 44,11.24 51.42,11.24 51.42,27.87 arc45 50.06,31.16 49.21,32.01 arc45 47.8,32.59 v46.9,32.59 v46.89,32.58 46.91,32.6 46.72,32.6 46.73,32.59 8.06,32.59 arc65 7.15,32.01 6.74,31.12 PROGRAM.1
N$1  (1 unrouted)
N$2
  Top 0.305: U$21.C R23.2
N$3
  Top 0.305: U2.31 36.84,39.05 arc45 35.69,41.83 34.81,42.71 Y1.1 35.34,43.27 arc45 35.53,43.72 C3.1
N$4
  Top 0.305: R24.2 U$23.C
N$5
  Top 0.305: U2.30 37.64,39.09 arc-45 38.79,41.87 39.63,42.71 Y1.2 39.07,43.3 arc-45 38.88,43.75 38.88,44.53 38.88,44.66 C4.1
N$6
  Top 0.305: R25.2 U$24.C
N$7
  Top 0.305: R26.2 U$25.C
N$8  (via drill 0.45)
  Top 0.305: U2.5 38.44,24.95 38.44,23.82 arc-90 37.2,22.58 35.07,22.58 arc-45 30.96,24.28 30.66,24.58 arc45 29.79,24.94 R2.1 29.56,25.06 29.56,25.25 arc90 28.13,26.68 v28.11,26.67 | U$1.S# 16.23,25.79 v16.25,25.8
  Bottom 0.305: v28.11,26.67 19.93,26.67 arc22 16.86,26.06 v16.26,25.81 arc45 v16.25,25.8
N$9
  Top 0.254: R26.1 44.41,1.37 14.51,1.37 arc-45 13.61,1.74 10.62,4.73 JP1.1
  Top 0.305: R26.1 44.7,1.41 arc45 46.19,0.8 51.01,0.8 arc45 52.22,1.3 R25.1 R24.1 55.07,1.54 55.38,1.23 arc45 56.33,0.84 61.33,0.84 arc45 62.27,1.23 62.74,1.7 62.9,1.7 R23.1 63.19,1.54
N$10  (1 unrouted)
N$11  (3 unrouted)
N$12  (3 unrouted)
N$13  (2 unrouted)
N$14
  Top 0.5: U$9.S1 15.77,18.25 arc90 16.4,17.61 17.67,17.61 arc90 18.3,18.25 U$9.S2
N$15
  Top 0.305: U$18.C 31.89,37.68 arc-45 30.47,38.27 30.06,38.68 R21.2
N$16
  Top 0.305: 17.04,11.82 U$12.SENSE
  Top 0.45: U$9.D2$1 17.04,11.82
  Top 0.5: R27.1 19.35,7.46 18.91,7.9 arc-45 18.62,8.6 18.62,12.7 arc45 18.33,13.4 18.3,13.43 U$9.D2$2
  Top 0.55: U$9.D2$1 U$9.D2$2
N$17
  Top 0.305: U$9.G1 14.49,17.93 arc45 14.79,17.22 16.09,15.92 arc-45 16.38,15.22 16.38,11.81 U$12.GATE
  Top 0.5: U$9.G1 14.49,20.12 arc-90 15.13,20.76 16.4,20.76 arc-90 17.04,20.12 U$9.G2
N$18  (1 unrouted)
N$19
  Top 0.305: U$7.S2 43.41,7.14 | 45.95,7.21 U$7.S1
  Top 0.5: U$7.S2 43.41,8.96 45.95,8.96 U$7.S1
N$20
  Top 0.305: U$8.SENSE 44,15.55 44,14.56 arc45 44.19,14.11 44.67,13.62 U$7.D2$1 U$7.D2$2 41.4,12.87 R9.1
N$22  (via drill 0.35, 0.45, 0.5)
  Top 0.305: v39.19,19.93 37.91,19.93 37.83,19.85 Q1.1 | U$8.GATE 44.65,15.55 44.65,14.75 45.13,14.26 v45.18,14.26 | U$7.G1 arc45 47.22,8.26 | U$7.G1 47.22,8.19 | 44.67,8.22 U$7.G2 44.67,6.44 47.22,6.44 U$7.G1 | v48.1,14.23 48.1,11.54 47.22,10.66 U$7.G1
  Bottom 0.305: v39.19,19.93 39.43,19.93 45.1,14.26 v45.18,14.26 45.19,14.27 48.1,14.27 arc90 v48.1,14.23
N$24
  Top 0.406: 11.2 arc-90 36.88,16.22 Q1.3
  Top 0.813: Q1.3 Q2.1
N$26
  Top 0.813: Q2.3 40.82,19.98 43.17,19.98 R12.2
N$28
  Top 0.5: U$10.S1 23.02,92.53 arc-90 23.66,93.17 24.93,93.17 arc-90 25.57,92.53 U$10.S2
N$29  (1 unrouted)
  Top 0.5: U$10.D2$1 U$10.D2$2 26.29,86.45 arc-90 26.92,85.82 26.92,83.82 R14.1
N$30  (via drill 0.35)
  Top 0.305: 24.3,92.17 U$10.G2 | U$10.G2 24.3,92.25 | U$10.G1 21.75,90.8 arc90 22.39,90.16 v24.31,90.16 | v24.31,90.16 24.3,90.16 U$10.G2 | v24.31,90.16 25.6,90.16 arc45 26.05,90.35 27.66,91.96 Q3.1
  Top 0.4: 24.3,91.31 U$10.G2 24.3,91.25 | 21.75,91.22 U$10.G1
  Top 0.45: U$11.GATE 23.68,85.22 v23.7,85.23
  Bottom 0.305: v23.7,85.23 23.7,89.55 v24.31,90.16
N$33
  Top 0.5: R15.2 30.27,83.91 Q4.1 30.47,86.66 31.12,86.66 arc90 31.67,87.2 31.67,90.22 arc90 31.07,90.81 30.47,90.81 Q3.3
N$34
  Top 0.45: Q4.3 Q4.3 arc45 26.45,88 20.94,88 arc45 19.52,87.41 R16.2
N$36
  Top 0.5: U$13.S1 22.2,18.25 arc90 22.83,17.62 24.13,17.62 arc90 24.77,18.25 24.77,19.14
  Top 0.508: U$13.S1 22.16,19.14 | 24.77,19.14 U$13.S2
N$37
  Top 0.305: U$13.D2$1 23.48,13.9 U$14.SENSE
  Top 0.406: 23.52,13.98 23.48,13.94 | U$13.D2$2 24.83,14.02
  Top 0.45: U$13.D2$1 23.52,13.98
  Top 0.5: U$13.D2$2
  Top 0.55: U$13.D2$2 U$13.D2$1
  Top 0.6: R17.1 U$13.D2$2
N$38
  Top 0.305: 22.84,11.77 U$14.GATE 22.84,11.77 22.84,15.12 arc45 22.55,15.83 21.22,17.16 arc-45 20.93,17.86 U$13.G1 20.93,19.73
  Top 0.5: U$13.G2 23.46,20.09 arc90 22.83,20.73 21.56,20.73 arc90 20.93,20.09 U$13.G1
OUT0_ADC  (via drill 0.45)  (1 unrouted)
  Top 0.45: v14.02,44.42 14.04,44.4 U$6.CH0
PGC_MAG
  Bottom 0.305: U$22.13 39.24,87.89 arc-45 40.66,88.48 46.74,88.48 arc-45 48.16,87.89 56.57,79.48 arc-45 58.03,75.95 58.03,47.1 arc45 58.76,45.33 PANEL.1
PGC_MC  (via drill 0.45)
  Top 0.305: U2.16 45.07,30.98 v46.87,30.98 v46.88,30.97 | v42.26,7.5 42.3,7.46 42.3,6.79 arc-90 41.17,5.66 37.03,5.66 arc-67 35.02,7 34.65,7.89 arc45 U$17.11
  Bottom 0.305: 13.79,30.97 v46.88,30.97 arc-45 48.6,30.26 48.62,30.25 arc-45 49.96,27 49.96,12.57 42.27,12.57 v42.27,7.51 v42.26,7.5 | 13.79,30.97 | 13.79,30.97 arc90 9.71,26.89 9.71,23.91 arc-90 6.59,20.79 PROGRAM.5
PGD_MAG
  Bottom 0.305: U$22.15 38.67,88.59 arc-45 40.09,89.18 47.08,89.18 arc-45 48.5,88.59 57.24,79.85 arc-45 58.7,76.32 58.7,57.55 58.7,57.26 58.7,48.97 arc45 59.43,47.2 PANEL.2
PGD_MC  (via drill 0.45)
  Top 0.305: v47.91,31.77 47.89,31.79 45.06,31.79 U2.17 | v41.33,6.53 41.12,6.32 37.66,6.32 arc-68 36.14,7.33 36.02,7.62 35.91,7.73 arc45 U$17.13
  Bottom 0.305: v41.33,6.53 43.16,6.53 43.16,11.89 50.68,11.89 50.68,27.66 arc45 49.45,30.63 48.93,31.15 arc22 48.12,31.69 47.92,31.77 arc45 v47.91,31.77 13.22,31.77 arc90 8.96,27.51 8.96,25.49 arc-90 6.65,23.18 PROGRAM.4
RESET_MAG  (1 unrouted)
  Bottom 0.305: U$17.15 37.18,7 arc90 39.25,4.93 49.77,4.93
RESET_MAG_EXT  (3 unrouted)
RESET_MC_EL  (via drill 0.45)
  Top 0.305: R10.1 v47.51,17.75 47.51,19.93 50.61,23.03 JP4.2 | U$8.ON 47.33,17.94 arc-90 R10.1 | R10.1 47.52,18.15
  Bottom 0.305: v47.51,17.75 49.25,17.75 49.25,13.26 41.86,13.26 38.45,9.85 U$17.18
RESET_MC_GNSS  (via drill 0.45)  (1 unrouted)
  Top 0.305: U2.24 42.44,38.33 arc-45 42.73,39.03 43.44,39.74 arc-45 43.95,39.95 v44.05,40.05
  Top 0.45: 23.04,81.22 U$11.ON 23.04,79.13 R13.1
  Bottom 0.305: v44.05,40.05 47.25,40.05 arc45 51.6,41.85 54.55,44.8 arc45 56.01,48.33 56.01,63.68
RPI_EPS_IO_1
  Top 0.305: U$22.1 49.98,91.01 58.25,91.01 59.86,89.4 59.86,86.67 U$20.1
RPI_EPS_IO_2
  Top 0.305: U$22.3 49.75,92.05 59.07,92.05 61.3,89.82 U$20.2
RX_GNSS  (via drill 0.45)
  Top 0.305: v31.74,25 31.74,26.11 arc-90 U2.44
  Bottom 0.305: v31.74,25 21.81,25 arc45 18.28,23.54 14.56,19.82 arc-45 12,18.76 5.58,18.76 arc-90 3.04,21.3 3.04,47.01
RX_MC_TX_MAG  (1 unrouted)
  Top 0.305: U2.14 48.03,29.41 arc-10 48.92,29.33 49.81,29.17 arc10 50.59,29.1 53.69,29.1 arc-90 54.77,28.02 54.77,27.36 arc45 54.96,26.91 56.02,25.85 R20.1 | COM_MAG.4 61,26.25
RX_MC_TX_MAIN  (via drill 0.45)  (1 unrouted)
  Top 0.305: U2.3 36.8,25.97 v36.8,23.42
  Bottom 0.305: v36.8,23.42 36.8,11.36 arc-45 35.91,9.21 U$17.14
RX_MC_TX_RPI  (via drill 0.45)  (1 unrouted)
  Top 0.305: v47.92,33.41 U2.19
  Bottom 0.305: v47.92,33.41 7.06,33.41 arc-90 4.64,35.83 4.64,39.66
SELECT  (via drill 0.45)
  Top 0.305: v53.28,38.89 arc45 53.05,38.35 U1.4 | U2.23 43.24,38.3 43.64,38.7 arc-45 44.11,38.89 44.11,38.95 v44.12,38.96 44.16,38.92 44.72,38.92 arc45 45.01,39.04 45.46,39.49 R100.2
  Bottom 0.305: v44.12,38.96 arc-45 44.29,38.89 51.15,38.89 | v53.28,38.89 51.15,38.89 | 51.15,38.89 arc-45 51.15,38.89
TRCLK>>COM  (via drill 0.45)
  Top 0.305: U1.2 54.35,38.95 arc45 v53.98,39.85
  Bottom 0.305: v53.98,39.85 53.83,39.85 53.77,39.91 arc-45 54.78,42.34 55.9,43.46 arc45 57.36,46.99 57.36,75.52 arc45 55.9,79.05 49.85,85.1 arc45 48.08,85.83 U$22.2
TRCLK_MC
  Top 0.305: U2.21 51.74,35.01 arc90 53.7,36.97 U1.3
TRCLK_RPI
  Top 0.305: U1.1 55.01,35.6 arc90 56.27,34.33 U$16.1
TRDAT>>COM  (via drill 0.45)
  Top 0.305: v50.92,39.86 50.92,39.74 arc-45 51.76,37.72 U1.6
  Bottom 0.305: U$22.4 44.8,85.57 45.24,85.13 arc45 45.86,84.87 47.96,84.87 arc-45 49.73,84.14 55.2,78.67 arc-45 56.66,75.14 56.66,47.57 arc-45 55.27,44.21 v50.92,39.86
TRDAT_MC
  Top 0.305: U2.22 50.24,35.81 arc90 51.09,36.66 51.09,37.28 U1.7
TRDAT_RPI
  Top 0.305: U1.5 52.41,39.48 arc-90 53.67,40.75 60.03,40.75 arc-90 61.3,39.48 U$16.2
TX_GNSS  (via drill 0.45)
  Top 0.305: U2.1 35.24,25.49 arc-45 34.95,24.79 34.42,24.26 34.12,24.26 v34.12,24.23
  Bottom 0.305: v34.12,24.23 v34.11,24.22 22.47,24.22 arc45 18.94,22.76 15.31,19.13 arc-45 12.75,18.07 4.92,18.07 arc-90 2.35,20.64 2.35,47.3
TX_MC_RX_MAG  (1 unrouted)
  Top 0.305: U2.15 48.15,30.21 arc-12 49.23,30.09 50.29,29.86 arc12 51.37,29.74 54.52,29.74 arc-45 55.22,29.45 56.02,28.65 R19.1 | COM_MAG.5 60.99,28.74
TX_MC_RX_MAIN  (via drill 0.45)  (1 unrouted)
  Top 0.305: v35.68,23.44 arc45 36.05,24.33 U2.2
  Bottom 0.305: v35.68,23.44 35.76,23.36 35.76,23.17 arc-45 35.97,22.66 35.97,11.96 arc-45 34.93,9.46 U$17.12
TX_MC_RX_RPI  (via drill 0.45)  (1 unrouted)
  Top 0.305: v46.88,34.19 45.06,34.19 U2.20
  Bottom 0.305: v46.88,34.19 9.23,34.19 arc-90 6.73,36.69
VDD_MAG
  Bottom 0.305: U$22.17 38.1,89.29 arc-45 39.52,89.88 47.4,89.88 arc-45 48.82,89.29 57.87,80.24 arc-45 59.33,76.71 59.33,53.42 arc45 60.06,51.65 PANEL.4
VREF_2V5
  Top 0.305: C13.1 24.28,36.47
  Top 0.45: U$6.VREF 20.29,41.89 arc-90 21.29,40.89 21.29,40.88 arc90 22.29,39.88 U$19.VOUT_FORCE U$19.VOUT_SENSE 23.45,39.23 arc-90 24.28,38.41 24.28,36.47

### Text on the board
tNames: +X | RESET | 5V0 | MC_EL | YOTSUBA_EM_MC_ver.2.2
bNames: -X | TR:RPI | TML:MAG | PWR/COM:RPI | COM:MAG | TML:MC | PWR:MAG | ADC IN